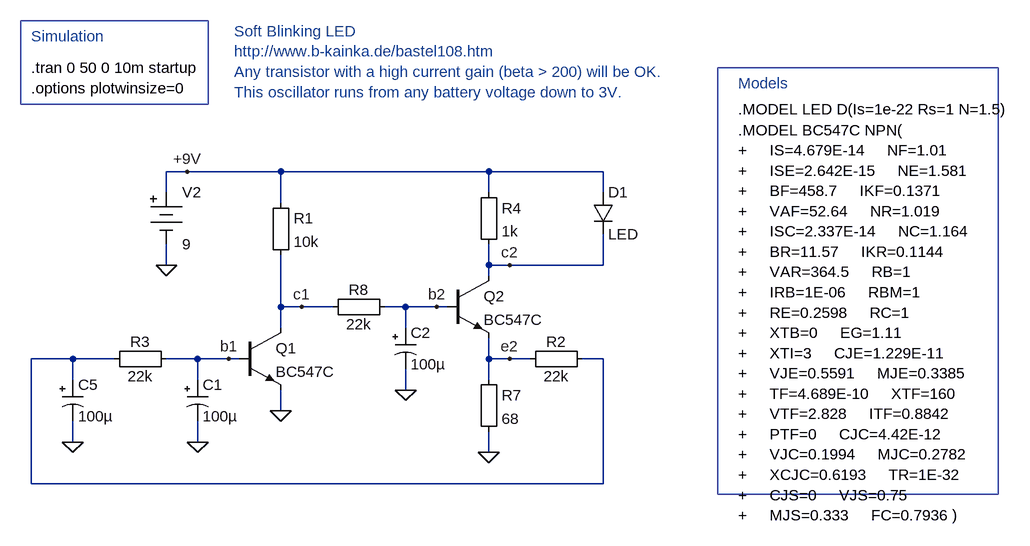
[diagram p0: schematic LED_soft_blinking.asc]
LED_soft_blinking.asc, the LTspice schematic file:
Version 4
SHEET 1 1284 696
WIRE -32 -144 -64 -144
WIRE 112 -144 -32 -144
WIRE 432 -144 112 -144
WIRE 608 -144 432 -144
WIRE -64 -112 -64 -144
WIRE 432 -112 432 -144
WIRE 608 -112 608 -144
WIRE 112 -96 112 -144
WIRE -64 0 -64 -32
WIRE 432 0 432 -32
WIRE 464 0 432 0
WIRE 608 0 608 -48
WIRE 608 0 464 0
WIRE 432 16 432 0
WIRE 112 64 112 -16
WIRE 144 64 112 64
WIRE 192 64 144 64
WIRE 304 64 272 64
WIRE 352 64 304 64
WIRE 368 64 352 64
WIRE 112 96 112 64
WIRE 304 96 304 64
WIRE -208 144 -272 144
WIRE -144 144 -208 144
WIRE -16 144 -64 144
WIRE 32 144 -16 144
WIRE 48 144 32 144
WIRE 432 144 432 112
WIRE 464 144 432 144
WIRE 496 144 464 144
WIRE 608 144 576 144
WIRE -208 176 -208 144
WIRE -16 176 -16 144
WIRE 432 176 432 144
WIRE 304 192 304 160
WIRE 112 224 112 192
WIRE -208 272 -208 240
WIRE -16 272 -16 240
WIRE 432 288 432 256
WIRE -272 336 -272 144
WIRE 608 336 608 144
WIRE 608 336 -272 336
FLAG 304 192 0
FLAG 432 288 0
FLAG -16 272 0
FLAG -208 272 0
FLAG 112 224 0
FLAG -64 0 0
FLAG 144 64 c1
FLAG 352 64 b2
FLAG 464 0 c2
FLAG 32 144 b1
FLAG 464 144 e2
FLAG -32 -144 +9V
SYMBOL npn 48 96 R0
SYMATTR InstName Q1
SYMATTR Value BC547C
SYMBOL npn 368 16 R0
SYMATTR InstName Q2
SYMATTR Value BC547C
SYMBOL diode 592 -112 R0
SYMATTR InstName D1
SYMATTR Value LED
SYMBOL Misc\\battery -64 -128 R0
SYMATTR InstName V2
SYMATTR Value 9
SYMBOL Misc\\EuropeanPolcap -224 176 R0
SYMATTR InstName C5
SYMATTR Value 100µ
SYMBOL Misc\\EuropeanPolcap -32 176 R0
SYMATTR InstName C1
SYMATTR Value 100µ
SYMBOL Misc\\EuropeanPolcap 288 96 R0
SYMATTR InstName C2
SYMATTR Value 100µ
SYMBOL Misc\\EuropeanResistor 416 160 R0
SYMATTR InstName R7
SYMATTR Value 68
SYMBOL Misc\\EuropeanResistor 176 80 R270
WINDOW 0 27 56 VTop 0
WINDOW 3 5 56 VBottom 0
SYMATTR InstName R8
SYMATTR Value 22k
SYMBOL Misc\\EuropeanResistor 96 -112 R0
SYMATTR InstName R1
SYMATTR Value 10k
SYMBOL Misc\\EuropeanResistor 480 160 R270
WINDOW 0 27 56 VTop 0
WINDOW 3 5 56 VBottom 0
SYMATTR InstName R2
SYMATTR Value 22k
SYMBOL Misc\\EuropeanResistor -160 160 R270
WINDOW 0 27 56 VTop 0
WINDOW 3 5 56 VBottom 0
SYMATTR InstName R3
SYMATTR Value 22k
SYMBOL Misc\\EuropeanResistor 416 -128 R0
SYMATTR InstName R4
SYMATTR Value 1k
TEXT -272 -304 Left 0 !.tran 0 50 0 10m startup
TEXT 816 -240 Left 0 !.MODEL LED D(Is=1e-22 Rs=1 N=1.5)
TEXT -272 -272 Left 0 !.options plotwinsize=0
TEXT 40 -360 Left 0 ;Soft Blinking LED\nhttp://www.b-kainka.de/bastel108.htm \nAny transistor with a high current gain (beta > 200) will be OK.\nThis oscillator runs from any battery voltage down to 3V.
TEXT 816 -208 Left 0 !.MODEL BC547C NPN( \n+     IS=4.679E-14     NF=1.01\n+     ISE=2.642E-15     NE=1.581\n+     BF=458.7     IKF=0.1371\n+     VAF=52.64     NR=1.019\n+     ISC=2.337E-14     NC=1.164\n+     BR=11.57     IKR=0.1144\n+     VAR=364.5     RB=1\n+     IRB=1E-06     RBM=1\n+     RE=0.2598     RC=1\n+     XTB=0     EG=1.11\n+     XTI=3     CJE=1.229E-11\n+     VJE=0.5591     MJE=0.3385\n+     TF=4.689E-10     XTF=160\n+     VTF=2.828     ITF=0.8842\n+     PTF=0     CJC=4.42E-12\n+     VJC=0.1994     MJC=0.2782\n+     XCJC=0.6193     TR=1E-32\n+     CJS=0     VJS=0.75\n+     MJS=0.333     FC=0.7936 )
TEXT -272 -352 Left 0 ;Simulation
TEXT 816 -280 Left 0 ;Models
RECTANGLE Normal 0 -248 -288 -376
RECTANGLE Normal 1216 352 784 -304

The netlist it stands for:
* LED_soft_blinking.asc
Q1 c1 b1 0 0 BC547C
Q2 c2 b2 e2 0 BC547C
D1 +9V c2 LED
V2 +9V 0 9
C5 N001 0 100µ
C1 b1 0 100µ
C2 b2 0 100µ
R7 e2 0 68
R8 c1 b2 22k
R1 +9V c1 10k
R2 e2 N001 22k
R3 N001 b1 22k
R4 +9V c2 1k
.model D D
.lib standard.dio
.model NPN NPN
.model PNP PNP
.lib standard.bjt
.tran 0 50 0 10m startup
.MODEL LED D(Is=1e-22 Rs=1 N=1.5)
.options plotwinsize=0
* Soft Blinking LED
* http://www.b-kainka.de/bastel108.htm
* Any transistor with a high current gain (beta > 200) will be OK.
* This oscillator runs from any battery voltage down to 3V.
.MODEL BC547C NPN(
+     IS=4.679E-14     NF=1.01
+     ISE=2.642E-15     NE=1.581
+     BF=458.7     IKF=0.1371
+     VAF=52.64     NR=1.019
+     ISC=2.337E-14     NC=1.164
+     BR=11.57     IKR=0.1144
+     VAR=364.5     RB=1
+     IRB=1E-06     RBM=1
+     RE=0.2598     RC=1
+     XTB=0     EG=1.11
+     XTI=3     CJE=1.229E-11
+     VJE=0.5591     MJE=0.3385
+     TF=4.689E-10     XTF=160
+     VTF=2.828     ITF=0.8842
+     PTF=0     CJC=4.42E-12
+     VJC=0.1994     MJC=0.2782
+     XCJC=0.6193     TR=1E-32
+     CJS=0     VJS=0.75
+     MJS=0.333     FC=0.7936 )
* Simulation
* Models
.backanno
.end